# Altium schematic sheet Sheet_4.schdoc
size 327 x 180 mm
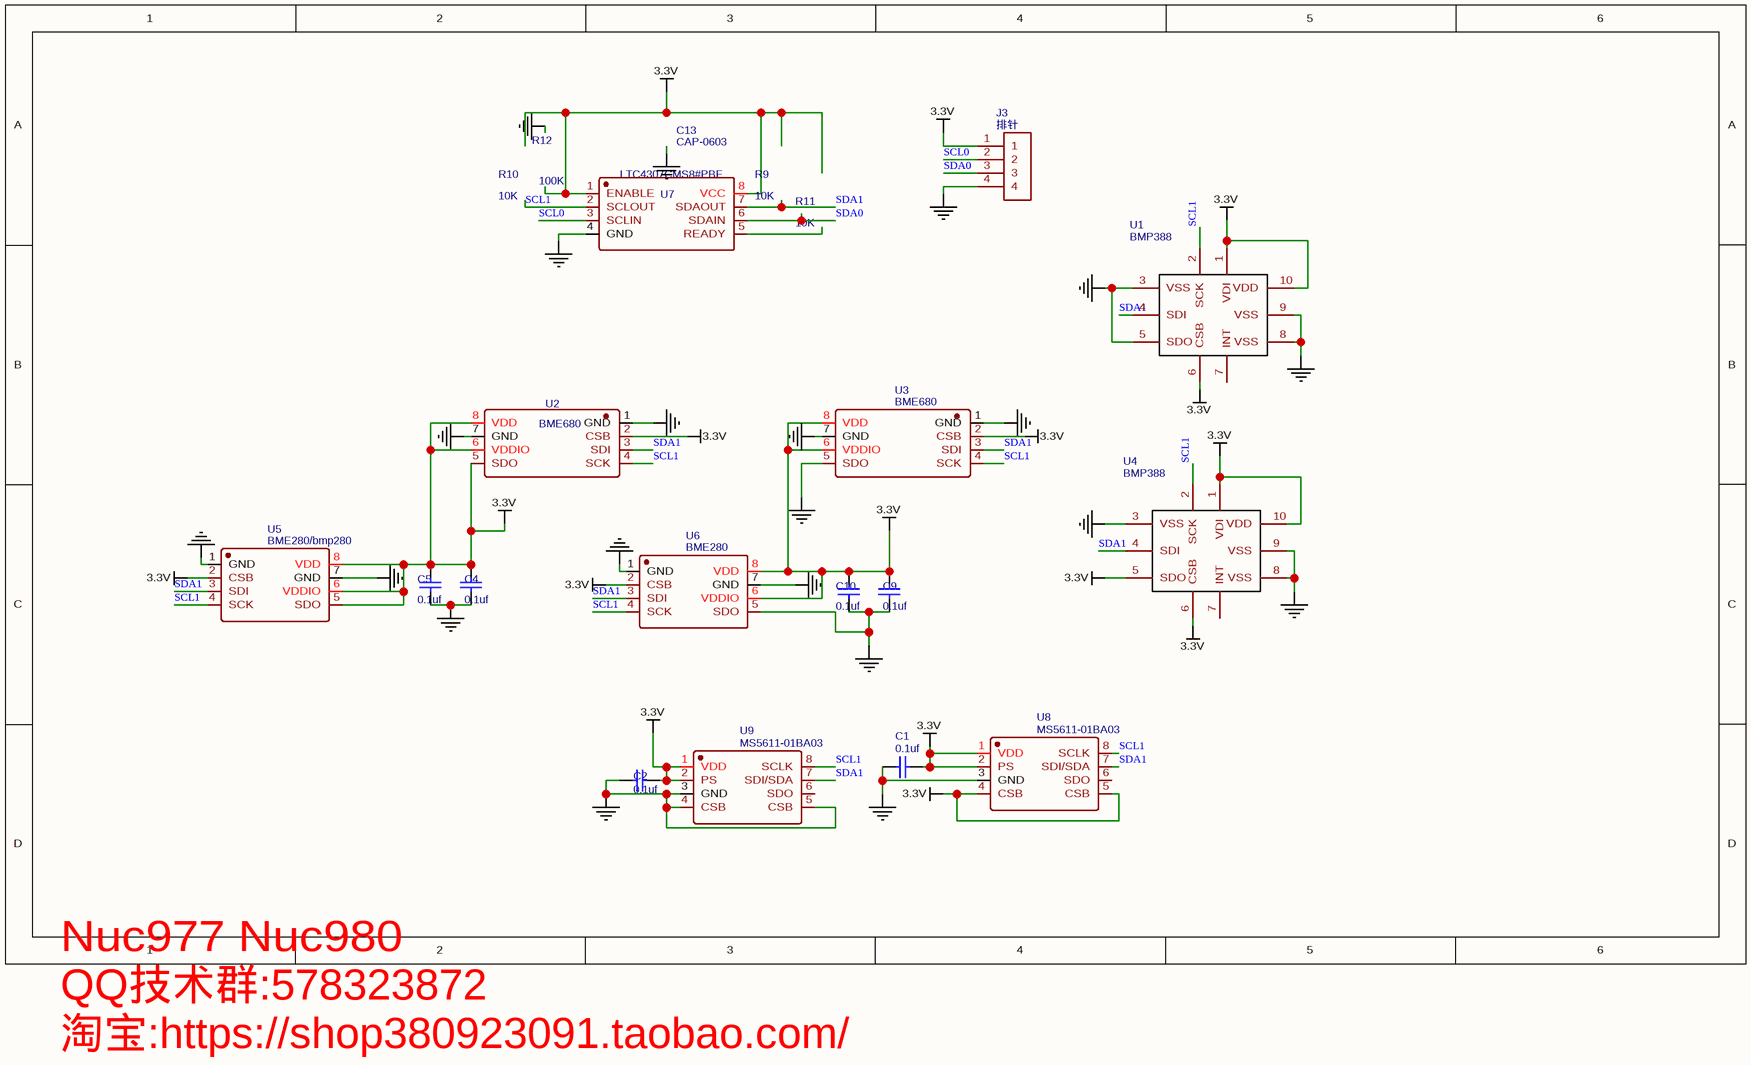
[diagram p0: Sheet_4.schdoc]

## Parts
C1  0.1uf  [N0603]
C2  0.1uf  [N0603]
C4  0.1uf  [N0603]
C5  0.1uf  [N0603]
C9  0.1uf  [N0603]
C10  0.1uf  [N0603]
C13  CAP-0603  [0603]
J3  排针  [PIN_4*2.54]
R9  10K  [0603]
R10  10K  [0603]
R11  10K  [0603]
R12  100K  [0603]
U1  BMP388  [NEWPCBLIB]
U2  BME680  [LGA-8-3X3MM]
U3  BME680  [LGA-8-3X3MM]
U4  BMP388  [NEWPCBLIB]
U5  BME280/bmp280  [LGA-8]
U6  BME280  [LGA-8]
U7  LTC4307CMS8#PBF  [MSOP-8]
U8  MS5611-01BA03  [QFN-8_5X3MM]
U9  MS5611-01BA03  [QFN-8_5X3MM]

## Nets
3.3V: C1.2 C2.2 C4.1 C5.1 C9.1 C10.1 J3.1 U1.1(VDI) U1.6(CSB) U1.10(VDD) U2.2(CSB) U2.5(SDO) U2.6(VDDIO) U2.8(VDD) U3.2(CSB) U3.6(VDDIO) U3.8(VDD) U4.1(VDI) U4.5(SDO) U4.6(CSB) U4.10(VDD) U5.2(CSB) U5.5(SDO) U5.6(VDDIO) U5.8(VDD) U6.2(CSB) U6.6(VDDIO) U6.8(VDD) U7.1(ENABLE) U7.8(VCC) U8.1(VDD) U8.2(PS) U8.4(CSB) U8.5(CSB) U9.1(VDD) U9.2(PS)
GND: C1.1 C2.1 C4.2 C5.2 C9.2 C10.2 J3.4 U1.3(VSS) U1.5(SDO) U1.8(VSS) U1.9(VSS) U2.1(GND) U2.7(GND) U3.1(GND) U3.5(SDO) U3.7(GND) U4.3(VSS) U4.8(VSS) U4.9(VSS) U5.1(GND) U5.7(GND) U6.1(GND) U6.5(SDO) U6.7(GND) U7.4(GND) U8.3(GND) U9.3(GND) U9.4(CSB) U9.5(CSB)
SCL0: J3.2 U7.3(SCLIN)
SCL1: U1.2(SCK) U2.4(SCK) U3.4(SCK) U4.2(SCK) U5.4(SCK) U6.4(SCK) U7.2(SCLOUT) U8.8(SCLK) U9.8(SCLK)
SDA0: J3.3 U7.6(SDAIN)
SDA1: U1.4(SDI) U2.3(SDI) U3.3(SDI) U4.4(SDI) U5.3(SDI) U6.3(SDI) U7.7(SDAOUT) U8.7(SDI/SDA) U9.7(SDI/SDA)

Not connected (* = marked no-connect by the designer): U1 7(INT); U4 7(INT); U7 5(READY); U8 6(SDO); U9 6(SDO)

## Notes on the sheet
- Nuc977 Nuc980
  QQ技术群:578323872
  淘宝:https://shop380923091.taobao.com/

## Library data of the parts
C13 = CAP-0603: BOM_描述: 0.1uF; BOM_Price: 0.1; BOM_Manufacturer Part: ?; spicePre: C; BOM_Supplier: LCSC; BOM_Supplier Part: undefined
J3 = 排针: Contributor: cansong; BOM_描述: 4*2.54mm; BOM_Manufacturer Part: 排针; spicePre: J
R9-R11 = 10K: BOM_Manufacturer: LIZ; BOM_Manufacturer Part: CR0603FA1002G; nameAlias: Value; BOM_Supplier: LCSC; spicePre: R; spiceSymbolName: CR0603FA1002G; BOM_描述: 10K; BOM_Supplier Part: C126901
R12 = 100K: BOM_Manufacturer: LIZ; BOM_Manufacturer Part: CR0603FA1002G; nameAlias: Value; BOM_描述: 10K; BOM_Supplier: LCSC; spicePre: R; spiceSymbolName: CR0603FA1002G; BOM_Supplier Part: C126901
U1 U4 = BMP388: Contributor: hexunyu; BOM_Manufacturer Part: bmp388; spicePre: U
U2 U3 = BME680: BOM_Manufacturer: Bosch Sensortec; Contributor: LCSC; BOM_Supplier: LCSC; BOM_Supplier Part: C125972; BOM_Manufacturer Part: BME680; spicePre: U
U5 = BME280/bmp280: BOM_Manufacturer: Bosch; BOM_Manufacturer Part: BME280; Contributor: LCSC; BOM_Supplier: LCSC; BOM_Supplier Part: C92489; spicePre: U
U6 = BME280: BOM_Manufacturer: Bosch; Contributor: LCSC; BOM_Supplier: LCSC; BOM_Manufacturer Part: BME280; BOM_Supplier Part: C92489; spicePre: U
U7 = LTC4307CMS8#PBF: BOM_Manufacturer: LINEAR; BOM_Supplier: LCSC; BOM_Manufacturer Part: LTC4307CMS8#PBF; BOM_Supplier Part: C107956; spicePre: U
U8 U9 = MS5611-01BA03: BOM_Manufacturer: MEAS; BOM_Supplier: LCSC; BOM_Manufacturer Part: MS5611-01BA03; image: //image.lceda.cn/szlcsc/C37148.jpg; BOM_Supplier Part: C37148; spicePre: U
C1 C2 C4 C5 C9 C10 = 0.1uf: BOM_Manufacturer Part: ?; spicePre: C